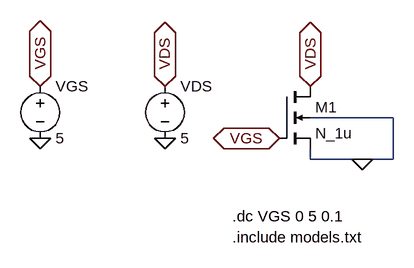
[diagram p0: schematic Draft3.asc]
Draft3.asc, the LTspice schematic file:
Version 4
SHEET 1 880 680
WIRE 624 288 496 288
WIRE 496 352 496 336
WIRE 576 352 496 352
WIRE 624 352 624 288
WIRE 624 352 576 352
FLAG 272 320 0
FLAG 80 320 0
FLAG 576 352 0
FLAG 80 240 VGS
IOPIN 80 240 BiDir
FLAG 272 240 VDS
IOPIN 272 240 BiDir
FLAG 448 320 VGS
IOPIN 448 320 BiDir
FLAG 496 240 VDS
IOPIN 496 240 BiDir
SYMBOL nmos4 448 240 R0
SYMATTR InstName M1
SYMATTR Value N_1u
SYMBOL Voltage 272 224 R0
SYMATTR InstName VDS
SYMATTR Value 5
SYMBOL Voltage 80 224 R0
SYMATTR InstName VGS
SYMATTR Value 5
TEXT 376 440 Left 2 !.dc VGS 0 5 0.1
TEXT 376 472 Left 2 !.include models.txt

The netlist it stands for:
* Draft3.asc
M1 VDS VGS 0 0 N_1u
VDS VDS 0 5
VGS VGS 0 5
.model NMOS NMOS
.model PMOS PMOS
.lib standard.mos
.dc VGS 0 5 0.1
.include models.txt
.backanno
.end